# EAGLE design SparkFun LoRaSerial 868MHz - 1W (EAGLE 9.6.2)
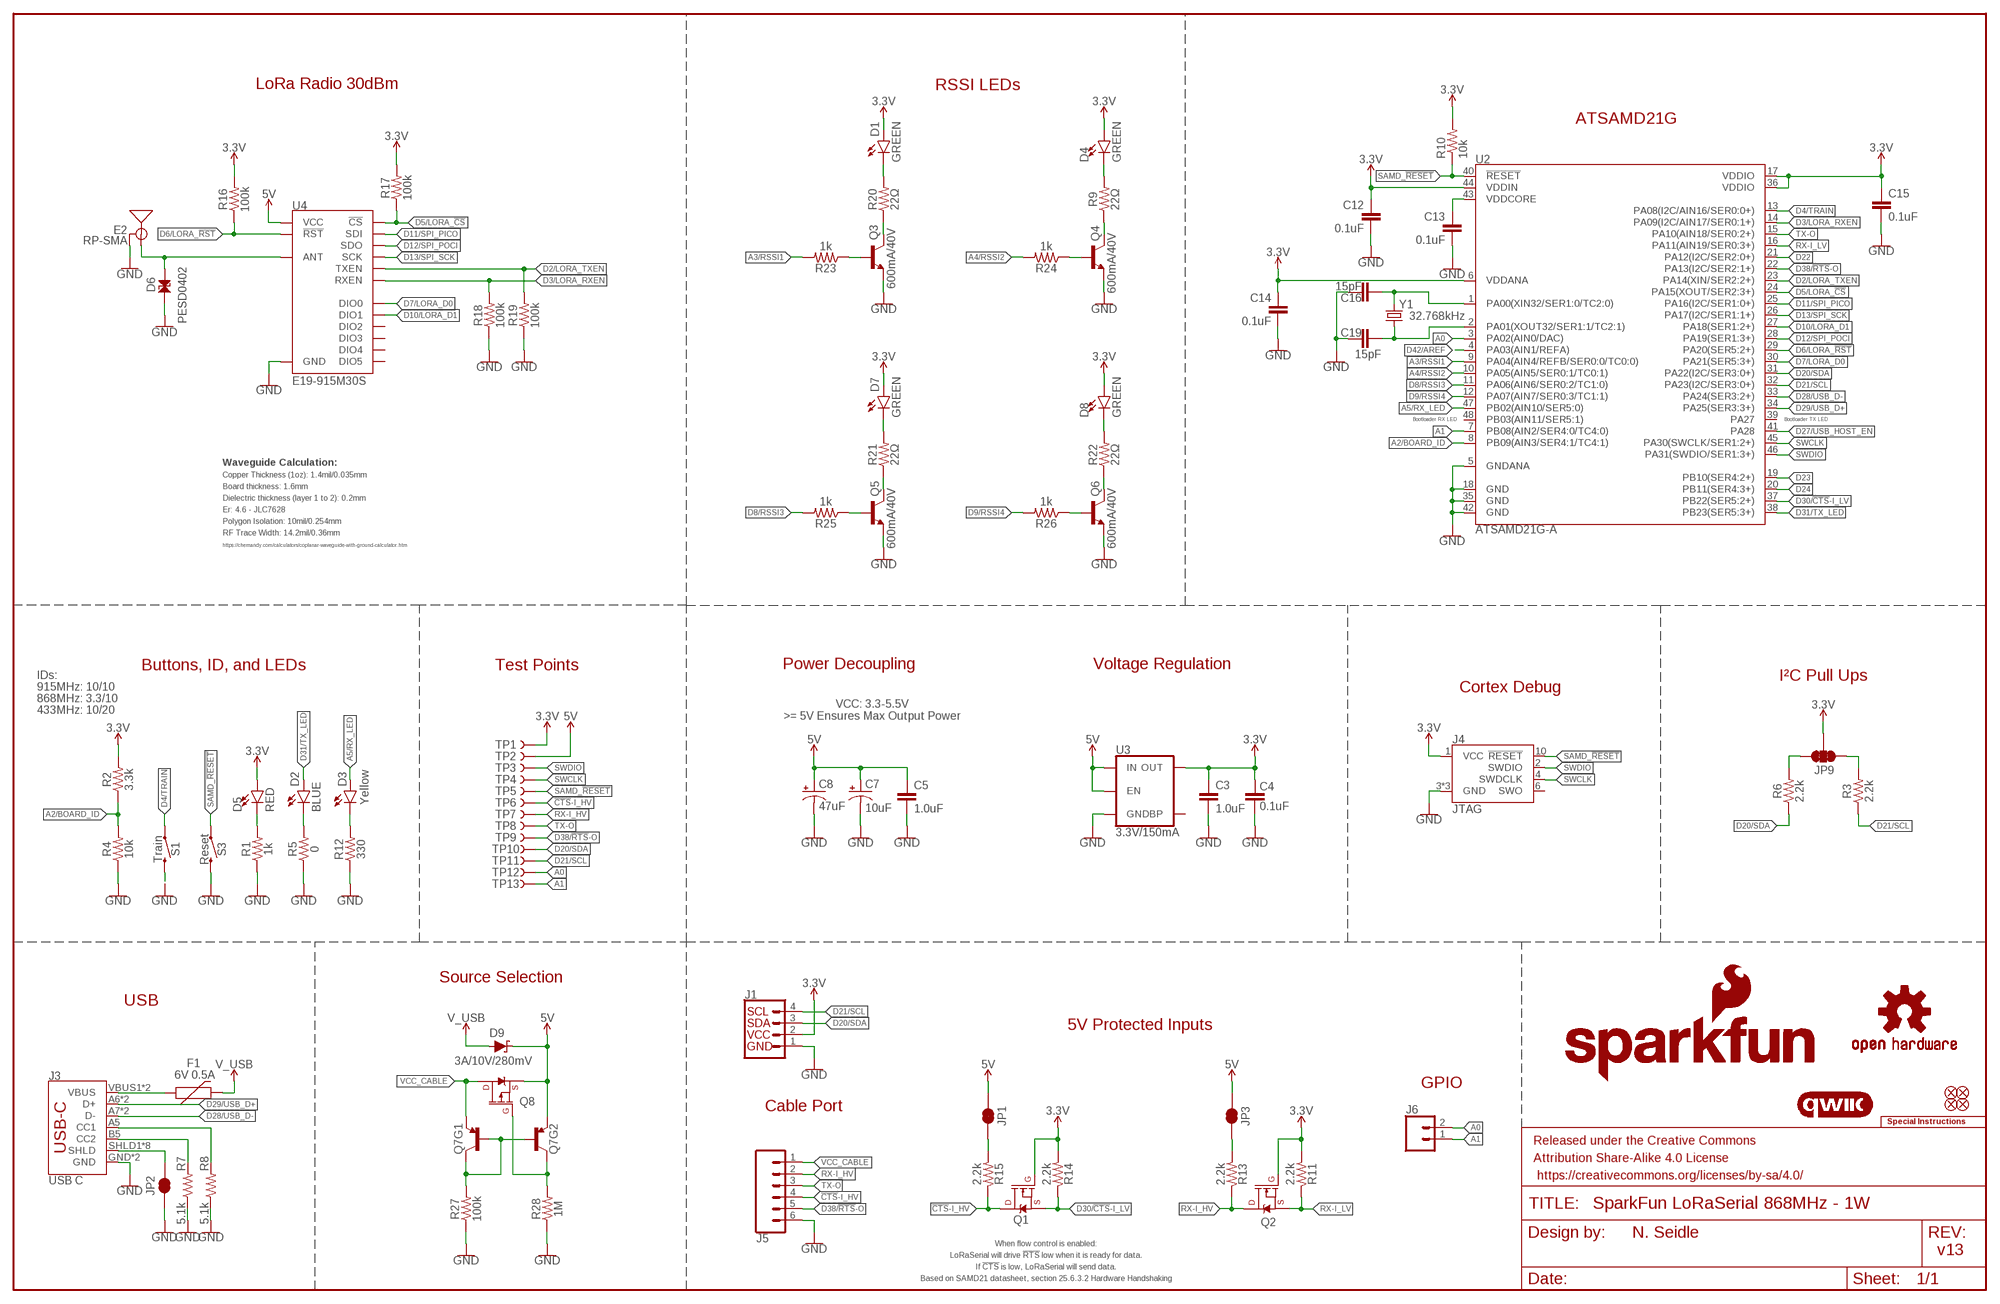
[diagram p0: schematic, sheet 1]

## Parts
C3  1.0uF  1.0UF-0603-16V-10%-X7R  [0603]
C4  0.1uF  0.1UF-0603-25V-5%  [0603]
C5  1.0uF  1.0UF-0603-16V-10%-X7R  [0603]
C7  10uF  10UF-POLAR-EIA3216-16V-10%(TANT)  [EIA3216]
C8  47uF  47UF-POLAR-EIA3528-10V-10%  [EIA3528]
C12  0.1uF  0.1UF-0603-25V-(+80/-20%)  [0603]
C13  0.1uF  0.1UF-0603-25V-(+80/-20%)  [0603]
C14  0.1uF  0.1UF-0603-25V-(+80/-20%)  [0603]
C15  0.1uF  0.1UF-0603-25V-(+80/-20%)  [0603]
C16  15pF  15PF-0603-50V-5%  [0603]
C19  15pF  15PF-0603-50V-5%  [0603]
D1  GREEN  LED-GREEN0603  [LED-0603]
D2  BLUE  LED-BLUE0603  [LED-0603]
D3  Yellow  LED-YELLOW0603  [LED-0603]
D4  GREEN  LED-GREEN0603  [LED-0603]
D5  RED  LED-RED0603  [LED-0603]
D6  PESD0402  PESD0402-0402T  [0402-TIGHT]
D7  GREEN  LED-GREEN0603  [LED-0603]
D8  GREEN  LED-GREEN0603  [LED-0603]
D9  3A/10V/280mV  DIODE-SCHOTTKY-BAT60A  [SOD-323]
E2  RP-SMA  ANTENNA-SMA-GROUNDEDEDGE_SMA  [SMA-EDGE]
F1  6V 0.5A  PPTC_6V500MA  [0805]
FID1  FIDUCIAL1X2  [FIDUCIAL-1X2]
FID2  FIDUCIAL1X2  [FIDUCIAL-1X2]
FID3  FIDUCIAL1X2  [FIDUCIAL-1X2]
FID4  FIDUCIAL1X2  [FIDUCIAL-1X2]
FRAME3  FRAME-LEDGER  [CREATIVE_COMMONS]
J1  QWIIC_RIGHT_ANGLE  QWIIC_CONNECTORJS-1MM  [JST04_1MM_RA]
J3  USB C  USB_C16PIN  [USB-C-16P]
J4  JTAG  CORTEX_JTAG_DEBUG_MINIMUM_PTH_NS  [2X5-PTH-1.27MM-NO_SILK]
J5  CONN_06JST-SMD-LOCKING  [JST-6-SMD-1.25MM-LOCKING]
J6  CONN_021X02_NO_SILK  [1X02_NO_SILK]
JP1  JUMPER-SMT_2_NC_TRACE_SILK  [SMT-JUMPER_2_NC_TRACE_SILK]
JP2  JUMPER-SMT_2_NC_TRACE_SILK  [SMT-JUMPER_2_NC_TRACE_SILK]
JP3  JUMPER-SMT_2_NC_TRACE_SILK  [SMT-JUMPER_2_NC_TRACE_SILK]
JP9  JUMPER-SMT_3_2-NC_TRACE_SILK  [SMT-JUMPER_3_2-NC_TRACE_SILK]
LOGO1  SPECIAL_INSTRUCTIONS-ORDERING  [ORDERING_INSTRUCTIONS]
LOGO2  SFE_LOGO_NAME_FLAME9_MM  [SFE_LOGO_NAME_FLAME_9MM]
LOGO3  QWIIC_LOGO_CONNECTOR  [QWIIC_5.5MM]
LOGO4  OSHW-LOGOMINI  [OSHW-LOGO-MINI]
LOGO5  SFE_LOGO_NAME9_MM  [SFE_LOGO_NAME_9MM]
Q1  20V/0.2A/8MHz/1.2Ω/1Vth  MOSFET-NCH-RE1C002UNTCL  [SOT-416FL]
Q2  20V/0.2A/8MHz/1.2Ω/1Vth  MOSFET-NCH-RE1C002UNTCL  [SOT-416FL]
Q3  600mA/40V  TRANS_NPN-MMBT2222AL  [SOT23-3]
Q4  600mA/40V  TRANS_NPN-MMBT2222AL  [SOT23-3]
Q5  600mA/40V  TRANS_NPN-MMBT2222AL  [SOT23-3]
Q6  600mA/40V  TRANS_NPN-MMBT2222AL  [SOT23-3]
Q7  TRANS_PNP_DUALSOT-363  [SOT363_PHILIPS]
Q8  20V/4.2A/52mΩ/1.4W  MOSFET_PCH-DMG2305UX-7  [SOT23-3]
R1  1k  1KOHM-0603-1/10W-1%  [0603]
R2  3.3k  3.3KOHM-0603-1/10W-1%  [0603]
R3  2.2k  2.2KOHM-0603-1/10W-1%  [0603]
R4  10k  10KOHM-0603-1/10W-1%  [0603]
R5  0  0OHM-0603-1/10W  [0603]
R6  2.2k  2.2KOHM-0603-1/10W-1%  [0603]
R7  5.1k  5.1KOHM5.1KOHM-0603-1/10W-1%  [0603]
R8  5.1k  5.1KOHM5.1KOHM-0603-1/10W-1%  [0603]
R9  22Ω  22OHM-0603-1/10W-1%  [0603]
R10  10k  10KOHM-0603-1/10W-1%  [0603]
R11  2.2k  2.2KOHM-0603-1/10W-1%  [0603]
R12  330  330OHM-0603-1/10W-1%  [0603]
R13  2.2k  2.2KOHM-0603-1/10W-1%  [0603]
R14  2.2k  2.2KOHM-0603-1/10W-1%  [0603]
R15  2.2k  2.2KOHM-0603-1/10W-1%  [0603]
R16  100k  100KOHM-0603-1/10W-1%  [0603]
R17  100k  100KOHM-0603-1/10W-1%  [0603]
R18  100k  100KOHM-0603-1/10W-1%  [0603]
R19  100k  100KOHM-0603-1/10W-1%  [0603]
R20  22Ω  22OHM-0603-1/10W-1%  [0603]
R21  22Ω  22OHM-0603-1/10W-1%  [0603]
R22  22Ω  22OHM-0603-1/10W-1%  [0603]
R23  1k  1KOHM-0603-1/10W-1%  [0603]
R24  1k  1KOHM-0603-1/10W-1%  [0603]
R25  1k  1KOHM-0603-1/10W-1%  [0603]
R26  1k  1KOHM-0603-1/10W-1%  [0603]
R27  100k  100KOHM-0603-1/10W-1%  [0603]
R28  1M  1MOHM-0603-1/4W-5%  [0603]
S1  Train  MOMENTARY-SWITCH-SPST-SMD-RIGHT-ANGLE  [TACTILE_SWITCH_SMD_RIGHT_ANGLE]
S3  Reset  MOMENTARY-SWITCH-SPST-SMD-5.2-TALL-REDUNDANT  [TACTILE_SWITCH_SMD_5.2MM]
TP1  TEST-POINT3X5  [PAD.03X.05]
TP2  TEST-POINT3X5  [PAD.03X.05]
TP3  TEST-POINT3X5  [PAD.03X.05]
TP4  TEST-POINT3X5  [PAD.03X.05]
TP5  TEST-POINT3X5  [PAD.03X.05]
TP6  TEST-POINT3X5  [PAD.03X.05]
TP7  TEST-POINT3X5  [PAD.03X.05]
TP8  TEST-POINT3X5  [PAD.03X.05]
TP9  TEST-POINT3X5  [PAD.03X.05]
TP10  TEST-POINT3X5  [PAD.03X.05]
TP11  TEST-POINT3X5  [PAD.03X.05]
TP12  TEST-POINT3X5  [PAD.03X.05]
TP13  TEST-POINT3X5  [PAD.03X.05]
U2  ATSAMD21G-A  [TQFP-48]
U3  3.3V/150mA  V_REG_MIC52053.3V  [SOT23-5]
U4  E19-915M30S  LORA-E19868MHZ  [E19-915M30S]
Y1  32.768kHz  CRYSTAL3.2X1.5MM  [CRYSTAL-SMD-3.2X1.5MM]

## Nets
3.3V [power]: C3.1 C4.2 C12.1 C14.1 C15.1 D1.A D4.A D5.A D7.A D8.A J1.2 J4.1(VCC) JP9.2 Q1.1(G) Q2.1(G) R2.2 R10.2 R11.2 R14.2 R16.2 R17.2 TP1.1 U2.6(VDDANA) U2.17(VDDIO) U2.36(VDDIO) U2.44(VDDIN) U3.5(OUT)
5V: C5.1 C7.+ C8.A(+) D9.C JP1.2 JP3.2 Q7.4(E) Q8.2(S) TP2.1 U3.1(IN) U3.3(EN) U4.11(VCC)
!CTS!-I_HV: J5.4 Q1.3(D) R15.1 TP6.1
A0: J6.2 TP12.1 U2.3(PA02(AIN0/DAC))
A1: J6.1 TP13.1 U2.7(PB08(AIN2/SER4:0/TC4:0))
A2/BOARD_ID: R2.1 R4.2 U2.8(PB09(AIN3/SER4:1/TC4:1))
A3/RSSI1: R23.2 U2.9(PA04(AIN4/REFB/SER0:0/TC0:0))
A4/RSSI2: R24.2 U2.10(PA05(AIN5/SER0:1/TC0:1))
A5/RX_LED: D3.A U2.47(PB02(AIN10/SER5:0))
CC1: J3.A5(CC1) R8.2
CC2: J3.B5(CC2) R7.2
D2/LORA_TXEN: R19.2 U2.23(PA14(XIN/SER2:2+)) U4.16(TXEN)
D3/LORA_RXEN: R18.2 U2.14(PA09(I2C/AIN17/SER0:1+)) U4.17(RXEN)
D4/TRAIN: S1.1 U2.13(PA08(I2C/AIN16/SER0:0+))
D5/LORA_!CS!: R17.1 U2.24(PA15(XOUT/SER2:3+)) U4.15(!CS)
D6/LORA_!RST!: R16.1 U2.29(PA20(SER5:2+)) U4.8(!RST)
D7/LORA_D0: U2.30(PA21(SER5:3+)) U4.7(DIO0)
D8/RSSI3: R25.2 U2.11(PA06(AIN6/SER0:2/TC1:0))
D9/RSSI4: R26.2 U2.12(PA07(AIN7/SER0:3/TC1:1))
D10/LORA_D1: U2.27(PA18(SER1:2+)) U4.6(DIO1)
D11/SPI_PICO: U2.25(PA16(I2C/SER1:0+)) U4.14(SDI)
D12/SPI_POCI: U2.28(PA19(SER1:3+)) U4.13(SDO)
D13/SPI_SCK: U2.26(PA17(I2C/SER1:1+)) U4.12(SCK)
D20/SDA: J1.3 R6.1 TP10.1 U2.31(PA22(I2C/SER3:0+))
D21/SCL: J1.4 R3.1 TP11.1 U2.32(PA23(I2C/SER3:0+))
D22: U2.21(PA12(I2C/SER2:0+))
D23: U2.19(PB10(SER4:2+))
D24: U2.20(PB11(SER4:3+))
D27/USB_HOST_EN: U2.41(PA28)
D28/USB_D-: J3.A7(D-) J3.B7(D-) U2.33(PA24(SER3:2+))
D29/USB_D+: J3.A6(D+) J3.B6(D+) U2.34(PA25(SER3:3+))
D30/!CTS!-I_LV: Q1.2(S) R14.1 U2.37(PB22(SER5:2+))
D31/TX_LED: D2.A U2.38(PB23(SER5:3+))
D38/!RTS!-O: J5.5 TP9.1 U2.22(PA13(I2C/SER2:1+))
D42/AREF: U2.4(PA03(AIN1/REFA))
GND: C3.2 C4.1 C5.2 C7.- C8.C(-) C12.2 C13.2 C14.2 C15.2 C16.1 C19.2 D6.1 E2.GND@0(GND) E2.GND@1(GND) E2.GND@2(GND) E2.GND@3(GND) J1.1 J3.GND J3.GND2(GND) J4.3(GND) J4.5(GND) J4.9(GND) J5.6 JP2.1 Q3.2(E) Q4.2(E) Q5.2(E) Q6.2(E) R1.1 R4.1 R5.1 R7.1 R8.1 R12.1 R18.1 R19.1 R27.1 R28.1 S1.2 S3.3 S3.4 U2.5(GNDANA) U2.18(GND) U2.35(GND) U2.42(GND) U3.2(GND) U4.1(GND) U4.9(GND) U4.10(GND) U4.18(GND) U4.20(GND) U4.21(GND) U4.22(GND)
LORA_ANT: D6.2 E2.SIG(SIGNAL) U4.19(ANT)
N$1: C19.1 U2.2(PA01(XOUT32/SER1:1/TC2:1)) Y1.P$1
N$2: C16.2 U2.1(PA00(XIN32/SER1:0/TC2:0)) Y1.P$2
N$3: D3.C R12.2
N$4: D2.C R5.2
N$5: JP3.1 R13.2
N$6: JP1.1 R15.2
N$7: D5.C R1.2
N$8: D4.C R9.2
N$9: D1.C R20.2
N$10: D7.C R21.2
N$11: D8.C R22.2
N$12: Q3.3(C) R20.1
N$13: Q3.1(B) R23.1
N$14: Q4.3(C) R9.1
N$15: Q4.1(B) R24.1
N$16: Q5.3(C) R21.1
N$17: Q5.1(B) R25.1
N$18: Q6.3(C) R22.1
N$19: Q6.1(B) R26.1
N$20: J3.SHLD1(SHLD) J3.SHLD2(SHLD) J3.SHLD3(SHLD) J3.SHLD4(SHLD) J3.SHLD5(SHLD) J3.SHLD6(SHLD) J3.SHLD7(SHLD) J3.SHLD8(SHLD) JP2.2
N$21: Q7.3(C) Q8.1(G) R28.2
N$22: Q7.2(B) Q7.5(B) Q7.6(C) R27.2
RX-I_HV: J5.2 Q2.3(D) R13.1 TP7.1
RX-I_LV: Q2.2(S) R11.1 U2.16(PA11(AIN19/SER0:3+))
SAMD_!RESET!: J4.10(!RESET) R10.1 S3.1 S3.2 TP5.1 U2.40(!RESET!)
SCL_PU1: JP9.1 R3.2
SDA_PU1: JP9.3 R6.2
SWCLK: J4.4(SWDCLK) TP4.1 U2.45(PA30(SWCLK/SER1:2+))
SWDIO: J4.2(SWDIO) TP3.1 U2.46(PA31(SWDIO/SER1:3+))
TX-O: J5.3 TP8.1 U2.15(PA10(AIN18/SER0:2+))
V_USB: D9.A F1.2
VCC_CABLE: J5.1 Q7.1(E) Q8.3(D)
VDDCORE: C13.1 U2.43(VDDCORE)
VUSB [power]: F1.1 J3.VBUS1(VBUS) J3.VBUS2(VBUS)
Unconnected: J4.6(SWO) U2.39(PA27) U2.48(PB03(AIN11/SER5:1)) U3.4(BP) U4.2(DIO5) U4.3(DIO4) U4.4(DIO3) U4.5(DIO2)

## Notes on the sheet
- LoRa Radio 30dBm | RSSI LEDs
- ATSAMD21G
- Bootloader RX LED | Bootloader TX LED
- Waveguide Calculation:
- Copper Thickness (1oz): 1.4mil/0.035mm
- Board thickness: 1.6mm
- Dielectric thickness (layer 1 to 2): 0.2mm
- Er: 4.6 - JLC7628
- Polygon Isolation: 10mil/0.254mm
- RF Trace Width: 14.2mil/0.36mm
- https://chemandy.com/calculators/coplanar-waveguide-with-ground-calculator.htm
- Buttons, ID, and LEDs | Test Points | Power Decoupling | Voltage Regulation
- IDs: | I²C Pull Ups
- 915MHz: 10/10 | Cortex Debug
- 868MHz: 3.3/10
- 433MHz: 10/20
- VCC: 3.3-5.5V
  >= 5V Ensures Max Output Power
- Source Selection
- USB
- 5V Protected Inputs
- GPIO
- Cable Port
- N. Seidle
- When flow control is enabled:
- LoRaSerial will drive !RTS! low when it is ready for data. | v13
- If !CTS! is low, LoRaSerial will send data.
- Based on SAMD21 datasheet, section 25.6.3.2 Hardware Handshaking

## Library data of the parts
C3 C5 = SparkFun-Capacitors:1.0UF: 1µF ceramic capacitors A capacitor is a passive two-terminal electrical component used to store electrical energy temporarily in an electric field.; PROD_ID: CAP-13930
C4 = SparkFun-Capacitors:0.1UF: 0.1µF ceramic capacitors A capacitor is a passive two-terminal electrical component used to store electrical energy temporarily in an electric field.; PROD_ID: CAP-08604
C7 = SparkFun-Capacitors:10UF-POLAR: 10.0µF polarized capacitors A capacitor is a passive two-terminal electrical component used to store electrical energy temporarily in an electric field.; PROD_ID: CAP-00811
C8 = SparkFun-Capacitors:47UF-POLAR: 47µF polarized capacitors A capacitor is a passive two-terminal electrical component used to store electrical energy temporarily in an electric field.; PROD_ID: CAP-08310
C12-C15 = SparkFun-Capacitors:0.1UF: 0.1µF ceramic capacitors A capacitor is a passive two-terminal electrical component used to store electrical energy temporarily in an electric field.; PROD_ID: CAP-00810
C16 C19 = SparkFun-Capacitors:15PF: 15pF ceramic capacitors A capacitor is a passive two-terminal electrical component used to store electrical energy temporarily in an electric field.; PROD_ID: CAP-07881
D1 D4 D7 D8 = SparkFun-LED:LED-GREEN: Green SMD LED Used in manufacturing of various products at SparkFun Packages: 0603 - SMD 0603 package [Product Link] <http://www.futureelectronics.com/en/technologies/semiconductors/optoelectronics/leds/Pages/9894312-LTST-C190GKT.aspx?CrossPart=HSMG-C190&IM=0> LilyPad 1206 - SMD1206 LilyPad package [Product Link] <http://www.futureelectronics.com/en/Technologies/Product.aspx?ProductID=IN150NGHARVATEKCORPORATION2049943&IM=0> 1206 - SMD1206 package [Product Link] <http://www.futureelectronics.com/en/technologies/semiconductors/optoelectronics/leds/Pages/8315665-LTST-C150KGKT.aspx?IM=0> 1206 Bottom Mount -SMD 1206 Bottom Mount [Product Link] <http://www.digikey.com/product-detail/en/lite-on-inc/LTST-C230KGKT/160-1456-1-ND/386854> SparkFun Products: Pro Mini 328 -5V <https://www.sparkfun.com/products/821> RedBoard <https://www.sparkfun.com/products/12757> MP3 Trigger <https://www.sparkfun.com/products/13720> Makey Makey <https://www.sparkfun.com/products/11076>; PROD_ID: DIO-00821
D2 = SparkFun-LED:LED-BLUE: Blue SMD LED Used in manufacturing of various products at SparkFun Packages: 0603 - SMD 0603 package [Product Link] <http://www.digikey.com/product-detail/en/SMLE12BC7TT86/511-1589-2-ND/1641808> 1206 - SMD1206 package [Product Link] <http://www.digikey.com/product-detail/en/lite-on-inc/LTST-C150TBKT/160-1643-1-ND/573584> SparkFun Products: ESP8266 Thing-Dev Board <https://www.sparkfun.com/products/13711> RedBoard <https://www.sparkfun.com/products/12757>; PROD_ID: DIO-08575
D3 = SparkFun-LED:LED-YELLOW: Yellow SMD LED Used in manufacturing several products at SparkFun. Packages: 0603 - SMD 0603 package[Product Link] <http://www.kingbrightusa.com/product.asp?catalog_name=LED&product_id=APT1608SYCK> 0603 -SMART - SMART SMD 0603 package (more efficient/more expensive) [Product Link] <http://www.osram-os.com/osram_os/en/products/product-catalog/led-light-emitting-diodes/smartled-0603/ly-l29k/index.jsp> LilyPad - SMD1206 package[Product Datasheet] <https://www.sparkfun.com/datasheets/DevTools/LilyPad/Q150YUS4.pdf> SparkFun Products: Blynk Board <https://www.sparkfun.com/products/13794> IOIO-OTG <https://www.sparkfun.com/products/13613> XBee Explorer Serial <https://www.sparkfun.com/products/13225>; PROD_ID: DIO-09003
D5 = SparkFun-LED:LED-RED: Red SMD LED Used in manufacturing of most products at SparkFun Packages: 0603 - SMD 0603 package [Product Link] <http://docs.avagotech.com/docs/AV02-0551EN> 0603 SMART - SMD 0603 SMART package ( more efficient and expensive)[Product Link] <http://www.osram-os.com/Graphics/XPic2/00077099_0.pdf> 1206 - SMD1206 package [Product Link] <https://www.sparkfun.com/datasheets/DevTools/LilyPad/Q150OVS4.pdff> SparkFun Products: Pro Mini 328 -5V <https://www.sparkfun.com/products/821> RedBoard <https://www.sparkfun.com/products/12757> IOIO-OTG <https://www.sparkfun.com/products/13613>; PROD_ID: DIO-00819
D6 = SparkFun-DiscreteSemi:PESD0402: ESD protection diode PESD is used to protect a signal line from ESD.; PROD_ID: DIO-15359
D9 = SparkFun-DiscreteSemi:DIODE-SCHOTTKY: Schottky diode A Schottky diode is a semiconductor diode which has a low forward voltage drop and a very fast switching action.; PROD_ID: DIO-14072
E2 = SparkFun-RF:ANTENNA-SMA-GROUNDED: SMA Antenna Connector w/ Ground Edge-mount and SMD SMA connectors for RF Antennas. **4-LAYER BOARD WARNING!!** When designing a 4-layer board using any of the SMD variants, you will need to manually add a cutout polygon on any internal power layers to make sure that you don't end up with exposed copper around the edge of the routed hole for these connectors. Exposed power copper could then short to the connector body - and that would be bad. Why hasn't anyone added the cutout polygons directly to the connector footprint? Well, your internal layers (usually 2 and 15) may be covered with GND polygons and you might well want the copper to go all the way to the edge, especially under the connector SIGNAL pin. So adding cutouts to the footprint might make matters worse, not better...; PROD_ID: CONN-08289
F1 = SparkFun-Fuses:PPTC: Resettable Fuse PPTC Resettable Fuse. Really a sort of resistor with a polymeric positive temperature coefficient whose resistance increases dramatically with an increase in temperature. When heated by the power passing through the resistance rises causing the current to be limited, protecting the circuit. This is achieved by the transition of the polymer from a crystalline to an amorphous state where the conductive carbon separates breaking the conductive pathways found in the cool crystalline structure. When a PPTC cools back down it resumes conducting letting the circuit turn back on. SparkFun Products: SparkFun RedBoard - Programmed with Arduino <https://www.sparkfun.com/products/12757> Pro Micro - 5V/16MHz <https://www.sparkfun.com/products/12640> Arduino Pro 328 - 5V/16MHz <https://www.sparkfun.com/products/10915> MP3 Trigger <https://www.sparkfun.com/products/13720>; PROD_ID: RES-13945
FID1-FID4 = SparkFun-Aesthetics:FIDUCIAL: Fiducial Alignment Points Point-of-reference for pick-and-place machines and other optical instruments.
FRAME3 = SparkFun-Aesthetics:FRAME-LEDGER: Schematic Frame - Ledger Standard 11x14 US Ledger frame
J1 = SparkFun-Connectors:QWIIC_CONNECTOR: SparkFun I2C Standard Qwiic Connector An SMD 1mm pitch JST connector makes it easy and quick (get it? Qwiic?) to connect I2C devices to each other. The Qwiic system <http://www.sparkfun.com/qwiic> enables fast and solderless connection between popular platforms and various sensors and actuators. We carry 200mm <https://www.sparkfun.com/products/14204>, 100mm <https://www.sparkfun.com/products/14205>, 50mm <https://www.sparkfun.com/products/14206>, and breadboard friendly <https://www.sparkfun.com/products/14207> Qwiic cables. We also offer 10 pcs strips <https://www.sparkfun.com/products/14323> the SMD connectors.; PROD_ID: CONN-13694
J3 = USB-C:USB_C: USB Type C 16Pin Connector
J4 = SparkFun-Connectors:CORTEX_JTAG_DEBUG_MINIMUM: Cortex Debug Connector - 10 pin Supports JTAG debug, Serial Wire debug, and Serial Wire Viewer. PTH and SMD connector options available. General Connector Information <http://infocenter.arm.com/help/topic/com.arm.doc.faqs/attached/13634/cortex_debug_connectors.pdf> Products: PTH Connector <http://www.digikey.com/product-detail/en/cnc-tech/3220-10-0100-00/1175-1627-ND/3883661> -via Digi-Key SparkFun PSoc <https://www.sparkfun.com/products/13229> SparkFun T <https://www.sparkfun.com/products/13810>
J5 = SparkFun-Connectors:CONN_06: Multi connection point. Often used as Generic Header-pin footprint for 0.1 inch spaced/style header connections On any of the 0.1 inch spaced packages, you can populate with these: Break Away Headers - Straight <https://www.sparkfun.com/products/116> (PRT-00116) Break Away Male Headers - Right Angle <https://www.sparkfun.com/products/553> (PRT-00553) Female Headers <https://www.sparkfun.com/products/115> (PRT-00115) Break Away Headers - Machine Pin <https://www.sparkfun.com/products/117> (PRT-00117) Break Away Female Headers - Swiss Machine Pin <https://www.sparkfun.com/products/743> (PRT-00743) Arduino Stackable Header - 6 Pin <https://www.sparkfun.com/products/9280> (PRT-09280) For SCREWTERMINALS and SPRING TERMINALS visit here: Screw Terimnals on SparkFun.com <https://www.sparkfun.com/search/results?term=Screw+Terminals> (5mm/3.5mm/2.54mm spacing) This device is also useful as a general connection point to wire up your design to another part of your project. Our various solder wires solder well into these plated through hole pads. Hook-Up Wire - Assortment (Stranded, 22 AWG) <https://www.sparkfun.com/products/11375> (PRT-11375) Hook-Up Wire - Assortment (Solid Core, 22 AWG) <https://www.sparkfun.com/products/11367> (PRT-11367) View the entire wire category on our website here <https://www.sparkfun.com/categories/141>; PROD_ID: CONN-16497
J6 = SparkFun-Connectors:CONN_02: Multi connection point. Often used as Generic Header-pin footprint for 0.1 inch spaced/style header connections On any of the 0.1 inch spaced packages, you can populate with these: Break Away Headers - Straight <https://www.sparkfun.com/products/116> (PRT-00116) Break Away Male Headers - Right Angle <https://www.sparkfun.com/products/553> (PRT-00553) Female Headers <https://www.sparkfun.com/products/115> (PRT-00115) Break Away Headers - Machine Pin <https://www.sparkfun.com/products/117> (PRT-00117) Break Away Female Headers - Swiss Machine Pin <https://www.sparkfun.com/products/743> (PRT-00743) For SCREWTERMINALS and SPRING TERMINALS visit here: Screw Terimnals on SparkFun.com <https://www.sparkfun.com/search/results?term=Screw+Terminals> (5mm/3.5mm/2.54mm spacing) This device is also useful as a general connection point to wire up your design to another part of your project. Our various solder wires solder well into these plated through hole pads. Hook-Up Wire - Assortment (Stranded, 22 AWG) <https://www.sparkfun.com/products/11375> (PRT-11375) Hook-Up Wire - Assortment (Solid Core, 22 AWG) <https://www.sparkfun.com/products/11367> (PRT-11367) View the entire wire category on our website here <https://www.sparkfun.com/categories/141> Special notes: Molex polarized connector foot print use with: PRT-08233 with associated crimp pins and housings. 2.54_SCREWTERM for use with PRT-10571. 3.5mm Screw Terminal footprints for PRT-08084 5mm Screw Terminal footprints for use with PRT-08432
JP1-JP3 = SparkFun-Jumpers:JUMPER-SMT_2_NC_TRACE: Normally closed trace jumper This jumper has a trace between two pads so it's normally closed (NC). Use a razor knife to open the connection. For best results follow the IPC guidelines for cutting traces: Cutout at least 0.063 mm (0.005 in). Remove all loose material to clean up the cut area. Seal the cut with an approved epoxy. Reapply solder to reclose the connection.
JP9 = SparkFun-Jumpers:JUMPER-SMT_3_2-NC_TRACE: Normally closed trace jumper (2 of 2 connections) This jumper has a trace between all three pads so they are normally closed (NC). Use a razor knife to open the connection(s). For best results follow the IPC guidelines for cutting traces: Cutout at least 0.063 mm (0.005 in). Remove all loose material to clean up the cut area. Seal the cut with an approved epoxy. Reapply solder to reclose the connection(s).
LOGO1 = SparkFun-Aesthetics:SPECIAL_INSTRUCTIONS: Special Ordering/Production Instructions Alert Symbol for special PCB ordering instructions or unique production process warnings. Ordering Instructions Production Instructions Types of information that should be added to box: Copper weight Soldermask color Silk color PCB thickness Number of layers PCB Standard: 1.6mm FR4 1 oz copper immersion silver plating red soldermask white silkscreen Types of information that should be added to box: Special wash requirements Depaneling instructions Humidification Glue curing Default text settings: 0.07 inch 9% ratio 50% line distance
LOGO2 = SparkFun-Aesthetics:SFE_LOGO_NAME_FLAME: SparkFun Font Logo w/ Flame This is the SparkFun full logo. The logo on the schematic will always be the same size; the package variant is the height of the flame part of the logo. Default layer for the logo on the board is tSilk.
LOGO3 = SparkFun-Aesthetics:QWIIC_LOGO: Qwiic Logos for placement on schematic and PCB. The 5.5mm silk logo is best for placing next to Qwiic connector.
LOGO4 = SparkFun-Aesthetics:OSHW-LOGO: Open-Source Hardware (OSHW) Logo This logo indicates the piece of hardware it is found on incorporates a OSHW license and/or adheres to the definition of open source hardware found here: http://freedomdefined.org/OSHW
LOGO5 = SparkFun-Aesthetics:SFE_LOGO_NAME: SparkFun Font Logo This is the SparkFun name logo. The logo on the schematic will always be the same size; the package variant is the height of the flame part of the logo (or the height the flame would be, if it were drawn). Default layer for the logo on the board is tSilk.
Q1 Q2 = SparkFun-DiscreteSemi:MOSFET-NCH: N-channel MOSFETs Voltage controlled devices that allow control of high current outputs. SparkFun Products: SparkFun OpenScale <https://www.sparkfun.com/products/13261> SparkFun Digital Sandbox <https://www.sparkfun.com/products/12651> SparkFun Monster Moto Shield <https://www.sparkfun.com/products/10182> SparkFun MOSFET Power Controller <https://www.sparkfun.com/products/11214>; PROD_ID: TRANS-14399
Q3-Q6 = SparkFun-DiscreteSemi:TRANS_NPN: NPN transistor Current controlled devices typically used to amplify current or used as a switch. BC547 - COM-08928 <http://www.sparkfun.com/products/8928> (TO-92 45V 100mA) (1.Collector 2.Base 3.Emitter) 2N3904 - COM-00521 <http://www.sparkfun.com/products/521> (TO-92 40V 200mA) (1.Emitter 2.Base 3.Collector) P2N2222A - COM-12852 <http://www.sparkfun.com/products/12852> (TO-92 40V 600mA) (1.Collector 2.Base 3.Emitter); PROD_ID: TRANS-08049
Q7 = SparkFun-DiscreteSemi:TRANS_PNP_DUAL: Dual PNP Transistors in Single Package The BCM857BS puts two PNP transistors in a single package. Bipolar (BJT) Transistor Array 2 PNP (Dual) 45V 100mA 100MHz 200mW Surface Mount SOT-363 Datasheet <https://www.diodes.com/assets/Datasheets/BCM857BS.pdf> SparkFun Products: SparkFun Pi Servo HAT V2 <https://www.sparkfun.com>; PROD_ID: TRANS-14386
Q8 = SparkFun-DiscreteSemi:MOSFET_PCH: P-channel MOSFETs Voltage controlled devices that allow control of high current outputs. SparkFun Products: SparkFun ESP32 Thing <https://www.sparkfun.com/products/13907> SparkFun ESP8266 Thing <https://www.sparkfun.com/products/13231> SparkFun Pi Servo HAT V2 <https://www.sparkfun.com/products/15316> DMG2305UX-7 (20V/4.2A/SOT23-3); PROD_ID: TRANS-14388
R1 R23-R26 = SparkFun-Resistors:1KOHM: 1kΩ resistor A resistor is a passive two-terminal electrical component that implements electrical resistance as a circuit element. Resistors act to reduce current flow, and, at the same time, act to lower voltage levels within circuits. - Wikipedia; PROD_ID: RES-07856
R2 = SparkFun-Resistors:3.3KOHM: 3.3kΩ resistor A resistor is a passive two-terminal electrical component that implements electrical resistance as a circuit element. Resistors act to reduce current flow, and, at the same time, act to lower voltage levels within circuits. - Wikipedia; PROD_ID: RES-07851
R3 R6 R11 R13-R15 = SparkFun-Resistors:2.2KOHM: 2.2kΩ resistor A resistor is a passive two-terminal electrical component that implements electrical resistance as a circuit element. Resistors act to reduce current flow, and, at the same time, act to lower voltage levels within circuits. - Wikipedia; PROD_ID: RES-08272
R4 R10 = SparkFun-Resistors:10KOHM: 10kΩ resistor A resistor is a passive two-terminal electrical component that implements electrical resistance as a circuit element. Resistors act to reduce current flow, and, at the same time, act to lower voltage levels within circuits. - Wikipedia; PROD_ID: RES-00824
R5 = SparkFun-Resistors:0OHM: 0Ω resistor A resistor is a passive two-terminal electrical component that implements electrical resistance as a circuit element. Resistors act to reduce current flow, and, at the same time, act to lower voltage levels within circuits. - Wikipedia; PROD_ID: RES-08609
R7 R8 = SparkFun-Resistors:5.1KOHM; PROD_ID: RES-12083
R9 R20-R22 = SparkFun-Resistors:22OHM: 22Ω resistor A resistor is a passive two-terminal electrical component that implements electrical resistance as a circuit element. Resistors act to reduce current flow, and, at the same time, act to lower voltage levels within circuits. - Wikipedia; PROD_ID: RES-08698
R12 = SparkFun-Resistors:330OHM: 330Ω resistor A resistor is a passive two-terminal electrical component that implements electrical resistance as a circuit element. Resistors act to reduce current flow, and, at the same time, act to lower voltage levels within circuits. - Wikipedia; PROD_ID: RES-00818
R16-R19 R27 = SparkFun-Resistors:100KOHM: 100kΩ resistor A resistor is a passive two-terminal electrical component that implements electrical resistance as a circuit element. Resistors act to reduce current flow, and, at the same time, act to lower voltage levels within circuits. - Wikipedia; PROD_ID: RES-07828
R28 = SparkFun-Resistors:1MOHM: 1MΩ resistor A resistor is a passive two-terminal electrical component that implements electrical resistance as a circuit element. Resistors act to reduce current flow, and, at the same time, act to lower voltage levels within circuits. - Wikipedia; PROD_ID: RES-07868
S1 = SparkFun-Switches:MOMENTARY-SWITCH-SPST: Momentary Switch (Pushbutton) - SPST Normally-open (NO) SPST momentary switches (buttons, pushbuttons). Variants PTH-12MM - 12mm square, through-hole Momentary Pushbutton Switch - 12mm Square <https://www.sparkfun.com/products/9190> (COM-09190) PTH-6.0MM, PTH-6.0MM-KIT - 6.0mm square, through-hole Mini Pushbutton Switch <https://www.sparkfun.com/products/97> (COM-00097) KIT package intended for soldering kit's - only one side of pads' copper is exposed. PTH-RIGHT-ANGLE-KIT - Right-angle, through-hole Right Angle Tactile Button <https://www.sparkfun.com/products/10791> - Used on SparkFun BigTime Watch Kit <https://www.sparkfun.com/products/11734> SMD-12MM - 12mm square, surface-mount Tactile Button - SMD (12mm) <https://www.sparkfun.com/products/12993> (COM-12993) Used on SparkFun PicoBoard <https://www.sparkfun.com/products/11888> SMD-4.5MM - 4.5mm Square Trackball Switch Used on SparkFun Blackberry Trackballer Breakout <https://www.sparkfun.com/products/13169> SMD-4.6MMX2.8MM - 4.60mm x 2.80mm, surface mount Used on SparkFun Pro Micro - RP2040 <https://www.sparkfun.com/products/17717> SMD-5.2MM, SMD-5.2-REDUNDANT - 5.2mm square, surface-mount Mini Pushbutton Switch - SMD <https://www.sparkfun.com/products/8720> (COM-08720) Used on Arduino Pro Mini <https://www.sparkfun.com/products/11114> REDUNDANT package connects both switch circuits together SMD-6.0X3.5MM - 6.0 x 3.5mm, surface mount Momentary Reset Switch SMD <https://www.sparkfun.com/products/8229> (COM-08229) SMD-6.2MM-TALL - 6.2mm square, surface mount Tactile Button - SMD (6mm) <https://www.sparkfun.com/products/12992> Used on SparkFun Digital Sandbox <https://www.sparkfun.com/products/12651> SMD-RIGHT-ANGLE - Right-angle, surface mount Used on SparkFun Block for Intel® Edison - Arduino <https://www.sparkfun.com/products/13036>; PROD_ID: COMP-12265
S3 = SparkFun-Switches:MOMENTARY-SWITCH-SPST: Momentary Switch (Pushbutton) - SPST Normally-open (NO) SPST momentary switches (buttons, pushbuttons). Variants PTH-12MM - 12mm square, through-hole Momentary Pushbutton Switch - 12mm Square <https://www.sparkfun.com/products/9190> (COM-09190) PTH-6.0MM, PTH-6.0MM-KIT - 6.0mm square, through-hole Mini Pushbutton Switch <https://www.sparkfun.com/products/97> (COM-00097) KIT package intended for soldering kit's - only one side of pads' copper is exposed. PTH-RIGHT-ANGLE-KIT - Right-angle, through-hole Right Angle Tactile Button <https://www.sparkfun.com/products/10791> - Used on SparkFun BigTime Watch Kit <https://www.sparkfun.com/products/11734> SMD-12MM - 12mm square, surface-mount Tactile Button - SMD (12mm) <https://www.sparkfun.com/products/12993> (COM-12993) Used on SparkFun PicoBoard <https://www.sparkfun.com/products/11888> SMD-4.5MM - 4.5mm Square Trackball Switch Used on SparkFun Blackberry Trackballer Breakout <https://www.sparkfun.com/products/13169> SMD-4.6MMX2.8MM - 4.60mm x 2.80mm, surface mount Used on SparkFun Pro Micro - RP2040 <https://www.sparkfun.com/products/17717> SMD-5.2MM, SMD-5.2-REDUNDANT - 5.2mm square, surface-mount Mini Pushbutton Switch - SMD <https://www.sparkfun.com/products/8720> (COM-08720) Used on Arduino Pro Mini <https://www.sparkfun.com/products/11114> REDUNDANT package connects both switch circuits together SMD-6.0X3.5MM - 6.0 x 3.5mm, surface mount Momentary Reset Switch SMD <https://www.sparkfun.com/products/8229> (COM-08229) SMD-6.2MM-TALL - 6.2mm square, surface mount Tactile Button - SMD (6mm) <https://www.sparkfun.com/products/12992> Used on SparkFun Digital Sandbox <https://www.sparkfun.com/products/12651> SMD-RIGHT-ANGLE - Right-angle, surface mount Used on SparkFun Block for Intel® Edison - Arduino <https://www.sparkfun.com/products/13036>; PROD_ID: SWCH-14139
TP1-TP13 = SparkFun-Connectors:TEST-POINT: SparkFun Test Points Bare copper test points for troubleshooting or In-Circuit-Testing. These are used by our Production team for verifying production board runs using pogo-pins on test beds. SparkFun Products: SparkFun LSM9DS1 Breakout <https://www.sparkfun.com/products/13284> SparkFun PSOC <https://www.sparkfun.com/products/13714> SparkFun Load Cell Amplifier <https://www.sparkfun.com/products/13879>
U2 = samd21-temp:ATSAMD21G: Atmel SAMD21G SMART ARM-Based Microcontroller The Atmel ® | SMART ™ SAM D21 is a series of low-power microcontrollers using the 32-bit ARM ® Cortex ® -M0+ processor, and ranging from 32- to 64-pins with up to 256KB Flash and 32KB of SRAM. The SAM D21 devices operate at a maximum frequency of 48MHz and reach 2.46 CoreMark/MHz. They are designed for simple and intuitive migration with identical peripheral modules, hex compatible code, identical linear address map and pin compatible migration paths between all devices in the product series. All devices include intelligent and flexible peripherals, Atmel Event System for inter-peripheral signaling, and support for capacitive touch button, slider and wheel user interfaces.; PROD_ID: IC-13064
U3 = SparkFun-IC-Power:V_REG_MIC5205: V_REG MIC5205 Standard 3.3V, 5V, and Adjustable 150mA LDO voltage regulator in SOT-23 layout. Micrel part MIC5205. BP (by-pass) pin is used to lower output noise with 470pF cap, may be left open. On the adjustable version BP is used to set output.; PROD_ID: VREG-00822
U4 = SparkFun-RF:LORA-E19: Chengdu Ebyte E19-915M30S - 915/868/433MHz LoRa (FSK) TRX Using SX1276 This is a LoRa (or optionally FSK) modulated transciver bassed on the Semtech SX1276. It has a high ouput power of 1W an a pre-installed U.FL connector. Can be used with LoRa WAN with DIO0, DIO1, and DIO2 hooked up to controller interrupt inputs SparkFun Products: SAMD21 Pro RF 1W <https://www.sparkfun.com/products/15034>; PROD_ID: IC-16573
Y1 = samd21-temp:CRYSTAL: Various standard crystals. Proven footprints.; PROD_ID: XTAL-13062

## Board
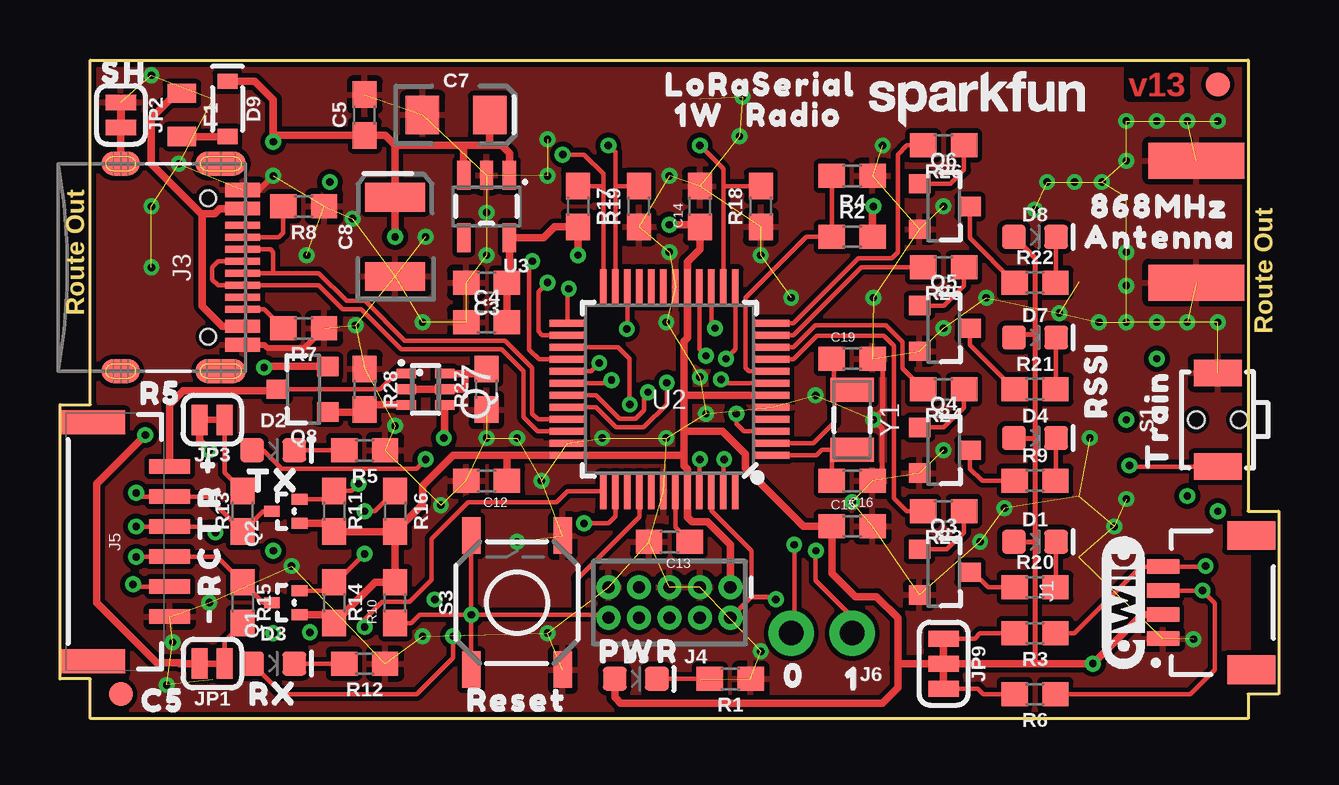
[diagram p1: board, top side]
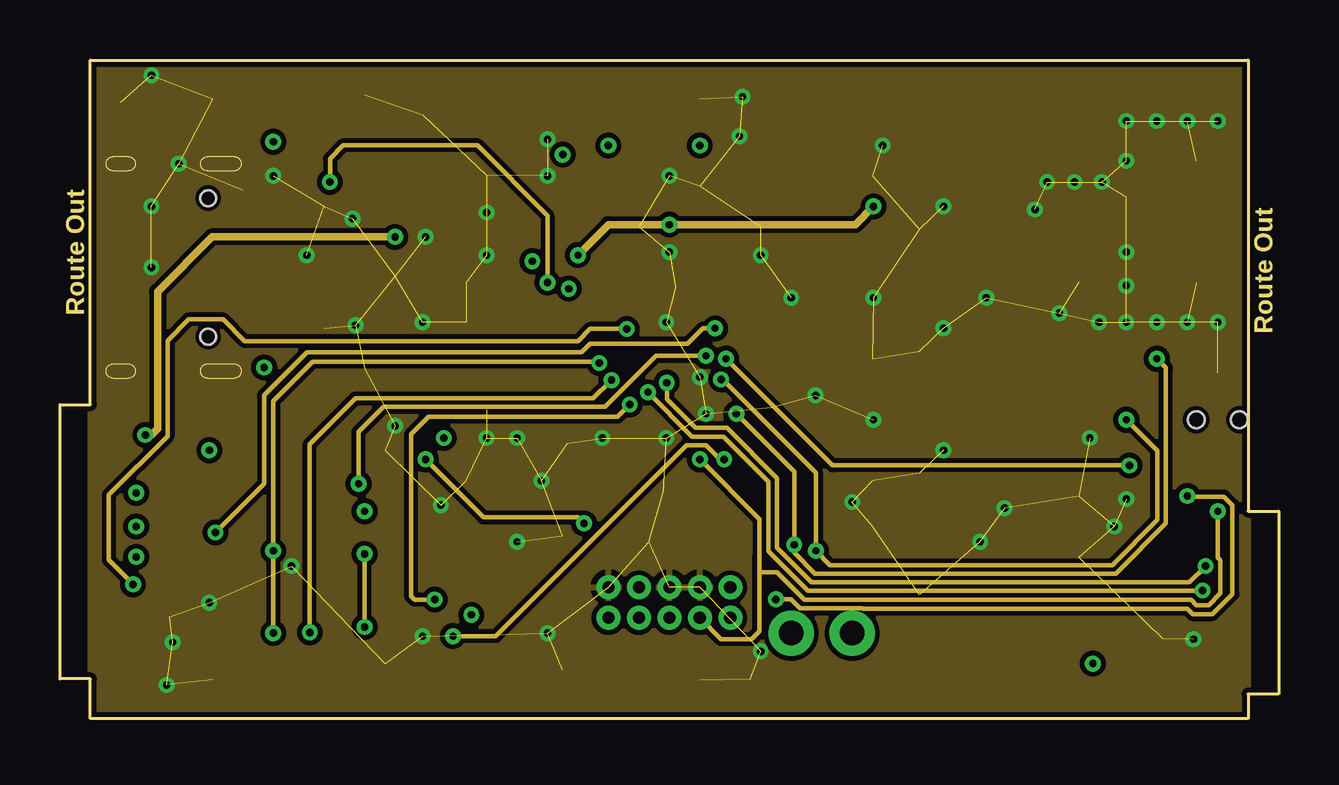
[diagram p2: board, inner layer Digital]
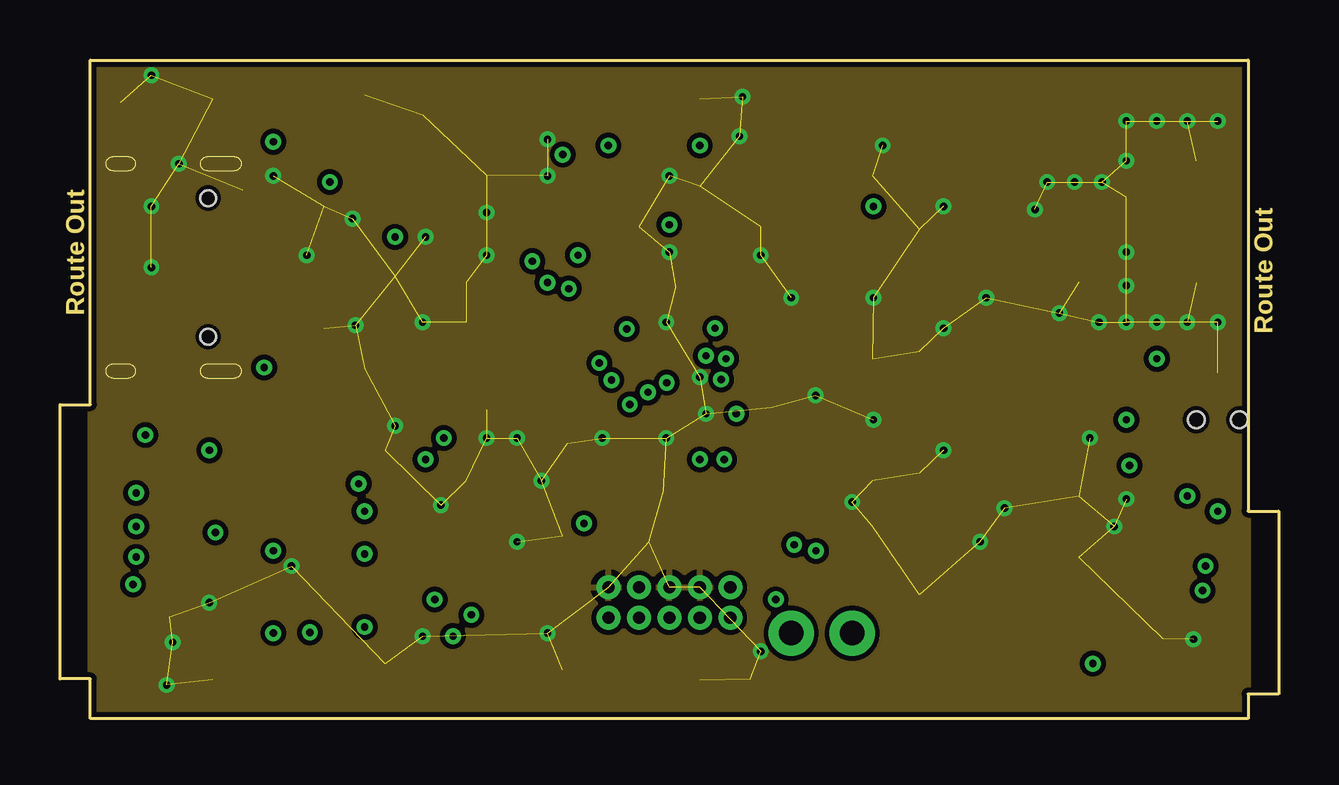
[diagram p3: board, inner layer GND]
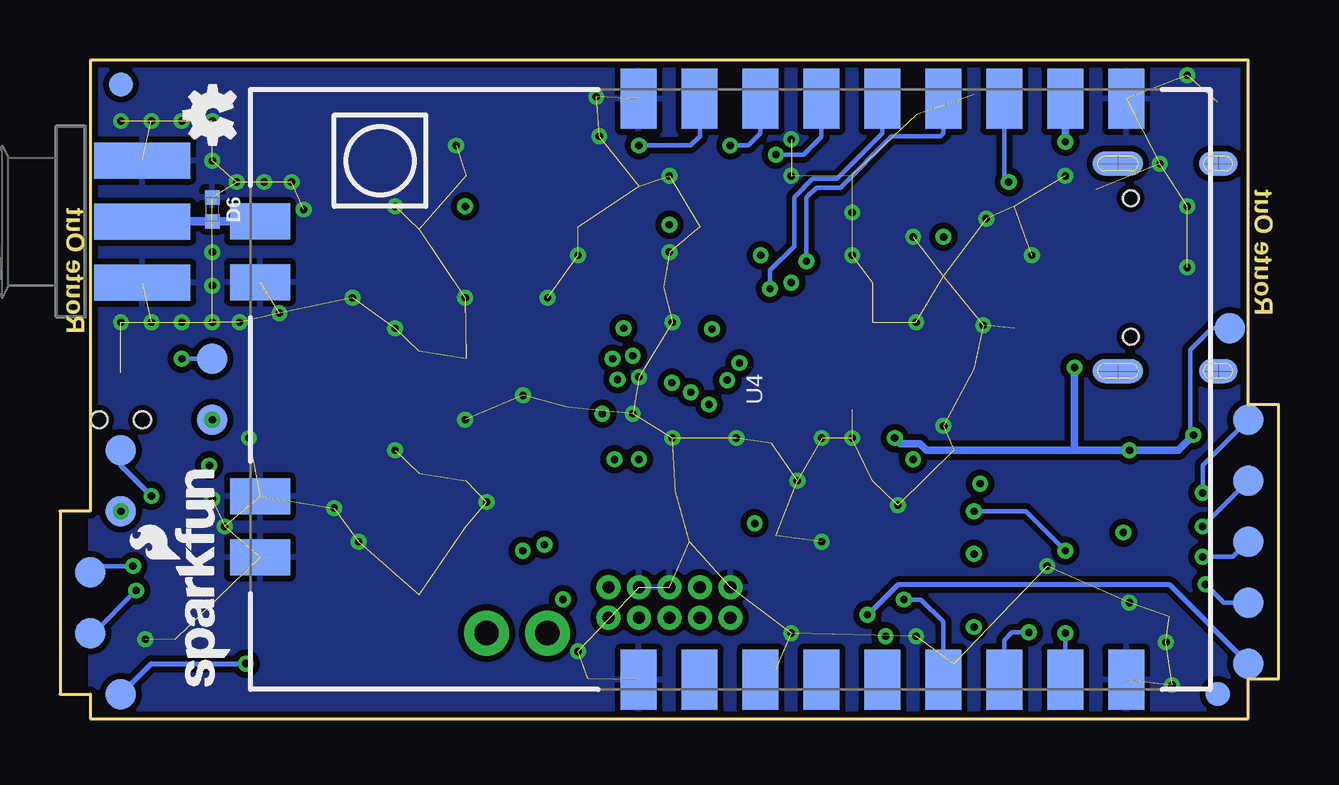
[diagram p4: board, bottom side, seen from below]

Size 50.8 x 27.44 mm. Coordinates in mm from the lower left corner, seen from the top.
Outline: 1.27,0 1.27,1.66 0,1.66 0,13.09 1.27,13.09 1.27,27.44 49.53,27.44 49.53,8.64 50.8,8.64 50.8,1.02 49.53,1.02 49.53,0 1.27,0
Copper layers (1+2*15+16): Top 0.035559375mm / dielectric 0.47751875mm / Digital 0.035559375mm / dielectric 0.47751875mm / GND 0.035559375mm / dielectric 0.47751875mm / Bottom 0.035559375mm
Design rules "SparkFun-4-Layer-General-JLCPCB": minimum track width 7mil, minimum drill 12mil, track to track 7mil, track to pad 7mil, pad to pad 7mil, via to via 7mil, smd to smd 7mil, copper to edge 7mil, drill to drill 7mil, minimum pad ring 7mil, minimum via ring 7mil, stop-mask expansion 3mil, vias tented up to drill 25mil, thermal gap 10mil

### Footprints (pad centres in the part's own frame; a part is rotated, then mirrored left to right if it is on the bottom)
0603 = smd 1.1 x 1: 1 -0.85,0; 2 0.85,0
EIA3216 = smd 1.4 x 1.6: + 1.4,0; - -1.4,0
EIA3528 = smd 1.2 x 2.5: A 1.65,0; C -1.65,0
LED-0603 = smd 1 x 1: A -0.877,0; C 0.877,0
0402-TIGHT = smd 0.6 x 0.6: 1 -0.5,0; 2 0.5,0
SOD-323 = smd 0.63 x 0.83: A 1.15,0; C -1.15,0
SMA-EDGE = smd 1.5 x 4: GND@0 -2.54,0; GND@1 2.54,0; SIG 0,0 | smd 1.5 x 4 bottom: GND@2 -2.54,0; GND@3 2.54,0
0805 = smd 0.8 x 1.2: 1 -0.9,0; 2 0.9,0
FIDUCIAL-1X2 = smd 1 x 1: 1 0,0
JST04_1MM_RA = smd 0.6 x 1.35: 1 -1.5,0; 2 -0.5,0; 3 0.5,0; 4 1.5,0 | smd 1.2 x 2: NC1 2.8,-3.675; NC2 -2.8,-3.675
USB-C-16P = smd 0.3 x 1.45: A5 -1.25,0; A6 -0.25,0; A7 0.25,0; A8 1.25,0; B5 1.75,0; B6 0.75,0; B7 -0.75,0; B8 -1.75,0 | smd 0.6 x 1.45: GND -3.225,0; GND2 3.225,0 | smd 1 x 2.1: SHLD1 -4.32,-0.915; SHLD2 4.32,-0.915 | smd 1 x 2.1 bottom: SHLD3 -4.32,-0.915; SHLD4 4.32,-0.915 | smd 1 x 1.6: SHLD5 -4.32,-5.095; SHLD8 4.32,-5.095 | smd 1 x 1.6 bottom: SHLD6 -4.32,-5.095; SHLD7 4.32,-5.095 | smd 0.55 x 1.45: VBUS1 -2.45,0; VBUS2 2.45,0 | hole 0.65: -2.89,-1.445; 2.89,-1.445
2X5-PTH-1.27MM-NO_SILK = drill 0.508 pad 1: 1 -2.54,-0.635; 2 -2.54,0.635; 3 -1.27,-0.635; 4 -1.27,0.635; 5 0,-0.635; 6 0,0.635; 7 1.27,-0.635; 8 1.27,0.635; 9 2.54,-0.635; 10 2.54,0.635
JST-6-SMD-1.25MM-LOCKING = smd 0.6 x 1.7: 1 -3.125,3.3; 2 -1.875,3.3; 3 -0.625,3.3; 4 0.625,3.3; 5 1.875,3.3; 6 3.125,3.3 | smd 1 x 2.7: NC1 4.975,0.1; NC2 -4.975,0.1
1X02_NO_SILK = drill 1.016 pad 1.88: 1 0,0; 2 2.54,0
SMT-JUMPER_2_NC_TRACE_SILK = smd 0.66 x 1.27: 1 -0.521,0; 2 0.521,0
SMT-JUMPER_3_2-NC_TRACE_SILK = smd 0.66 x 1.27: 1 -1.041,0; 2 0,0; 3 1.041,0
SOT-416FL = smd 0.46 x 0.65: 1 -0.5,-1.1; 2 0.5,-1.1; 3 0,0.05
SOT23-3 = smd 0.8 x 0.9: 1 -0.95,-1; 2 0.95,-1; 3 0,1.1
SOT363_PHILIPS = smd 0.4 x 0.8: 1 -0.65,-0.8; 2 0,-0.8; 3 0.65,-0.8; 4 0.65,0.8; 5 0,0.8; 6 -0.65,0.8
TACTILE_SWITCH_SMD_RIGHT_ANGLE = smd 1.1 x 2: 1 -1.95,0; 2 1.95,0 | hole 0.7: 0,0.9; 0,-0.9
TACTILE_SWITCH_SMD_5.2MM = smd 1.524 x 0.762: 1 -2.794,1.905; 2 2.794,1.905; 3 -2.794,-1.905; 4 2.794,-1.905
PAD.03X.05 = smd 1.27 x 1.27: 1 0,0
TQFP-48 = smd 1.5 x 0.28: 1 -4.25,2.75; 2 -4.25,2.25; 3 -4.25,1.75; 4 -4.25,1.25; 5 -4.25,0.75; 6 -4.25,0.25; 7 -4.25,-0.25; 8 -4.25,-0.75; 9 -4.25,-1.25; 10 -4.25,-1.75; 11 -4.25,-2.25; 12 -4.25,-2.75; 25 4.25,-2.75; 26 4.25,-2.25; 27 4.25,-1.75; 28 4.25,-1.25; 29 4.25,-0.75; 30 4.25,-0.25; 31 4.25,0.25; 32 4.25,0.75; 33 4.25,1.25; 34 4.25,1.75; 35 4.25,2.25; 36 4.25,2.75 | smd 0.28 x 1.5: 13 -2.75,-4.25; 14 -2.25,-4.25; 15 -1.75,-4.25; 16 -1.25,-4.25; 17 -0.75,-4.25; 18 -0.25,-4.25; 19 0.25,-4.25; 20 0.75,-4.25; 21 1.25,-4.25; 22 1.75,-4.25; 23 2.25,-4.25; 24 2.75,-4.25; 37 2.75,4.25; 38 2.25,4.25; 39 1.75,4.25; 40 1.25,4.25; 41 0.75,4.25; 42 0.25,4.25; 43 -0.25,4.25; 44 -0.75,4.25; 45 -1.25,4.25; 46 -1.75,4.25; 47 -2.25,4.25; 48 -2.75,4.25
SOT23-5 = smd 0.55 x 1.2: 1 -0.95,-1.3; 2 0,-1.3; 3 0.95,-1.3; 4 0.95,1.3; 5 -0.95,1.3
E19-915M30S = smd 2.5 x 1.5: 1 12.1,-3.82; 2 12.1,-1.28; 3 12.1,1.26; 4 12.1,3.8; 5 12.1,6.34; 6 12.1,8.88; 7 12.1,11.42; 8 12.1,13.96; 9 12.1,16.5; 10 -12.1,16.5; 11 -12.1,13.96; 12 -12.1,11.42; 13 -12.1,8.88; 14 -12.1,6.34; 15 -12.1,3.8; 16 -12.1,1.26; 17 -12.1,-1.28; 18 -12.1,-3.82 | smd 1.5 x 2.5: 19 -7,-19.6; 20 -4.46,-19.6; 21 4.46,-19.6; 22 7,-19.6
CRYSTAL-SMD-3.2X1.5MM = smd 1 x 1.8: P$1 -1.25,0; P$2 1.25,0

### Placement (x,y rotation side)
C3  17.78,18.16 180 top
C4  17.78,16.51 0 top
C5  12.7,25.15 90 top
C7  16.51,25.15 0 top
C8  13.97,20.07 90 top
C12  17.78,9.91 180 top
C13  25.4,7.37 180 top
C14  26.67,21.34 90 top
C15  33.02,8.01 0 top
C16  33.02,9.91 180 top
C19  33.02,14.99 0 top
D1  40.64,7.37 0 top
D2  8.89,11.18 0 top
D3  8.89,2.29 0 top
D4  40.64,11.69 0 top
D5  24,1.66 0 top
D6  44.45,21.21 270 bottom
D7  40.64,15.88 0 top
D8  40.64,20.07 0 top
D9  6.99,25.4 270 top
E2  47.37,20.7 90 bottom
F1  5.08,25.15 270 top
FID1  2.54,1.02 0 bottom
FID2  48.26,26.42 0 bottom
FID3  48.26,26.42 0 top
FID4  2.54,1.02 0 top
FRAME3  91.44,-9.14 0 top  (outside the outline)
J1  45.97,4.83 90 top
J3  7.62,18.8 270 top
J4  25.4,4.83 180 top
J5  1.27,7.37 270 top
J6  33.02,3.56 180 top
JP1  6.35,2.29 180 top
JP2  2.54,25.15 270 top
JP3  6.35,12.45 180 top
JP9  36.83,2.29 270 top
LOGO1  73.66,50.55 0 top  (outside the outline)
LOGO2  44.96,5.85 90 bottom
LOGO3  44.32,4.83 90 top
LOGO4  44.45,25.15 90 bottom
LOGO5  38.23,25.91 0 top
Q1  8.89,4.83 90 top
Q2  8.89,8.64 90 top
Q3  36.83,6.1 270 top
Q4  36.83,11.18 270 top
Q5  36.83,16.26 270 top
Q6  36.83,21.34 270 top
Q7  15.24,13.72 270 top
Q8  10.16,13.72 90 top
R1  27.94,1.66 180 top
R2  33.02,20.07 0 top
R3  40.64,3.56 180 top
R4  33.02,22.61 180 top
R5  12.7,11.18 180 top
R6  40.64,1.02 180 top
R7  10.16,16.26 180 top
R8  10.16,21.34 180 top
R9  40.64,9.91 0 top
R10  13.97,4.83 90 top
R11  11.43,8.64 270 top
R12  12.7,2.29 180 top
R13  7.62,8.64 90 top
R14  11.43,4.83 270 top
R15  7.62,4.83 270 top
R16  13.97,8.64 270 top
R17  21.59,21.34 270 top
R18  29.21,21.34 90 top
R19  24.13,21.34 90 top
R20  40.64,5.46 0 top
R21  40.64,13.72 0 top
R22  40.64,18.16 0 top
R23  36.83,8.64 180 top
R24  36.83,13.72 180 top
R25  36.83,18.8 180 top
R26  36.83,23.88 180 top
R27  17.78,13.72 90 top
R28  12.7,13.72 270 top
S1  48.26,12.45 90 top
S3  19.05,4.83 90 top
TP1  48.26,1.02 0 bottom
TP2  2.03,16.26 0 bottom
TP3  48.26,11.18 0 bottom
TP4  48.26,8.64 0 bottom
TP5  1.27,2.29 0 bottom
TP6  1.27,7.37 0 bottom
TP7  1.27,12.45 0 bottom
TP8  1.27,9.91 0 bottom
TP9  1.27,4.83 0 bottom
TP10  49.53,3.56 0 bottom
TP11  49.53,6.1 0 bottom
TP12  44.45,14.99 0 bottom
TP13  44.45,12.45 0 bottom
U2  25.4,13.72 180 top
U3  17.78,21.34 180 top
U4  22.86,13.72 270 bottom
U$1  [1W1]  26.67,25.15 0 top
U$2  [RESET0]  19.05,0.77 0 top
U$4  [TRAIN0]  45.72,12.45 90 top
U$5  [RADIO2]  30.61,25.15 0 top
U$6  [01]  30.61,1.78 0 top
U$7  [PWR0]  24.13,2.8 0 top
U$8  [868MHZ0]  45.85,21.34 0 top
U$9  [ANTENNA1]  45.85,20.07 0 top
U$10  [RX1]  8.89,1.02 0 top
U$11  [TX0]  8.89,9.91 0 top
U$12  [#0]  6.22,10.54 0 top
U$13  [#1]  6.22,4.32 90 top
U$14  [R3]  6.22,5.59 90 top
U$15  [T2]  6.22,8.01 90 top
U$16  [C0]  6.22,6.74 90 top
U$17  [R1]  6.22,9.28 90 top
U$18  [LORASERIAL0]  29.21,26.42 0 top
U$19  [C50]  4.3,0.75 0 top
U$20  [R50]  4.2,13.55 0 top
U$21  [RSSI0]  43.18,14.1 90 top
U$22  [10]  33.02,1.66 0 top
U$23  [SH0]  2.67,26.93 0 top
Y1  33.02,12.45 270 top

### Tracks (layer width: path | path; a pad name or v marks a point on that pad's centre or on a via)
3.3V  (via drill 0.3)
  Top 0.203: D8.A 40.64,19.19 40.64,16.01 | 40.64,16.01 40.64,11.69 | 40.64,11.69 40.64,7.37 | 40.64,7.37 40.64,2.29 | D1.A 40.64,7.37 | D4.A 40.64,11.69 | D7.A 39.89,16.01 40.64,16.01
  Top 0.305: U2.6 26.01,13.47 | 26.01,13.47 26.01,15.73 26.15,15.87 U2.17 26.15,19.04 26.67,19.56 C14.1 26.58,20.58 v25.4,20.58 | C4.2 C3.1 18.73,18.27 U3.5 20.16,20.04 20.61,20.49 R17.2 v21.59,19.31 | R16.2 R10.2 13.13,5.68 R14.2 11.08,4.33 Q1.1 | J4.1 27.94,7.24 26.98,8.2 26.35,8.2 26.15,8.4 U2.44 26.15,10.38 26.01,10.53 26.01,11.05 | 18.67,10.97 U2.36 25.93,10.97 26.01,11.05 | C12.1 18.63,10.93 18.67,10.97 | 26.01,11.05 26.01,11.94 | 26.01,11.94 26.01,13.47 | 26.01,11.94 26.03,11.97 27.62,11.97 28.57,11.02 28.57,10.42 30.99,8.01 C15.1 32.17,6.06 33.15,5.08 34.04,5.08 34.92,4.2 34.92,2.29 | 18.67,10.97 16.39,10.97 15.11,9.7 15.11,8.93 R16.2 | R16.2 R11.2 11.08,8.14 Q2.1 | J1.2 45.09,4.33 v43.05,2.29 40.64,2.29 JP9.2 34.92,2.29 | R2.2 33.87,21.3 v33.91,21.34 | D5.A 23.13,0.88 23.37,0.64 34.29,0.64 34.92,1.27 34.92,2.29
  Digital 0.305: v21.59,19.31 22.86,20.58 v25.4,20.58 33.15,20.58 v33.91,21.34
  Bottom 0.203: TP1.1 46.99,2.29 v43.05,2.29
5V  (via drill 0.3)
  Top 0.305: 13.97,23.88 13.55,24.3 C5.1 8.93,24.3 8.89,24.26 | U3.1 18.73,23.57 18.41,23.88 17.91,23.88 | 13.97,23.88 16.76,23.88 | 16.76,23.88 17.91,23.88 | U3.3 16.83,23.81 16.76,23.88 | JP1.2 5,2.29 4.97,2.31 4.04,2.31 1.52,4.83 1.52,9.78 v3.56,11.81 | C7.+ 17.91,23.88 | JP3.2 5.83,11.57 v6.22,11.18 | Q8.2 8.55,14.67 v8.51,14.63 | Q7.4 16.04,11.73 v16,11.69 | v13.97,20.07 C8.A 13.97,23.88 | D9.C 8.12,26.55 8.89,25.79 8.89,24.26 | 8.89,24.26 v8.89,24.03
  Digital 0.305: v13.97,20.07 6.35,20.07 4.06,17.78 4.06,12.07 3.81,11.81 v3.56,11.81
  Bottom 0.178: v3.56,11.81 3.68,11.94 3.68,15.37 2.79,16.26 TP2.1
  Bottom 0.305: v8.89,24.03 U4.11 | v3.56,11.81 4.19,11.18 v6.22,11.18 8.51,11.18 | 8.51,11.18 14.69,11.18 14.97,11.46 15.77,11.46 v16,11.69 | v8.51,14.63 8.51,11.18
!CTS!-I_HV  (via drill 0.3)
  Top 0.178: Q1.3 8.47,4.83 R15.1 6.55,6.75 J5.4 3.19,6.75 v3.17,6.74
  Bottom 0.178: v3.17,6.74 1.91,6.74 TP6.1
A0  (via drill 0.3)
  Top 0.178: v28.19,12.7 28.19,12.28 28.5,11.97 U2.3 | v30.61,7.24 30.61,3.69 J6.2
  Digital 0.178: v28.19,12.7 30.61,10.29 v30.61,7.24 30.61,6.9 31.47,6.04 44.01,6.04 46.1,8.13 46.1,14.61 v45.72,14.99
  Bottom 0.178: v45.72,14.99 TP12.1
A1  (via drill 0.3)
  Top 0.178: U2.7 27.72,13.97 v27.56,14.13 | v31.51,6.99 31.5,6.98 31.5,5.76 33.02,4.24 J6.1
  Digital 0.178: v27.56,14.13 27.61,14.13 31.51,10.23 v31.51,6.99 32.1,6.4 43.86,6.4 45.74,8.28 45.74,11.15 TP13.1
  other vias: 44.45,12.45
A2/BOARD_ID
  Top 0.178: U2.8 28.71,14.47 28.57,14.61 28.57,17.53 31.11,20.07 R2.1 R4.2
A3/RSSI1
  Top 0.178: U2.9 30.58,14.97 31.55,15.95 34.34,15.95 34.76,15.53 34.76,9.19 35.31,8.64 R23.2
A4/RSSI2
  Top 0.178: U2.10 30.57,15.47 31.49,16.39 34.42,16.39 35.11,15.69 35.11,14.59 R24.2
A5/RX_LED  (via drill 0.3)
  Top 0.178: U2.47 27.65,10.76 v27.69,10.8 | v16.38,3.43 16.38,2.54 14.86,1.02 9.28,1.02 D3.A
  Digital 0.178: v27.69,10.8 27.51,10.8 26.92,11.4 26.12,11.4 18.16,3.43 v16.38,3.43
CC1
  Top 0.178: J3.A5 9.12,20.05 9.31,20.24 R8.2
CC2
  Top 0.178: J3.B5 8.52,17.05 R7.2
D2/LORA_TXEN  (via drill 0.3)
  Top 0.178: U2.23 23.15,22.23 | 23.15,22.23 23.15,23.59 v22.86,23.88 | R19.2 23.19,22.19 23.15,22.23
  Bottom 0.178: v22.86,23.88 22.1,23.88 21.6,24.38 U4.16
D3/LORA_RXEN  (via drill 0.3)
  Top 0.178: U2.14 27.65,22.23 | 27.65,22.23 27.65,22.9 v26.67,23.88 | R18.2 27.69,22.19 27.65,22.23
  Bottom 0.178: v26.67,23.88 24.51,23.88 24.13,24.26 U4.17
D4/TRAIN  (via drill 0.3)
  Top 0.178: U2.13 28.15,15.38 v27.76,14.99 | S1.1 44.62,10.5 v44.58,10.54
  Digital 0.178: v44.58,10.54 32.21,10.54 v27.76,14.99
D5/LORA_!CS!  (via drill 0.3)
  Top 0.178: U2.24 22.65,22.23 | 22.65,22.23 22.65,22.69 21.84,23.5 v20.95,23.5 | R17.1 22.61,22.19 22.65,22.23
  Bottom 0.178: v20.95,23.5 19.81,23.5 19.06,24.25 U4.15
D6/LORA_!RST!  (via drill 0.3)
  Top 0.178: U2.29 22.14,14.47 v22.48,14.81 | R16.1 13.12,8.64 v12.7,8.64
  Digital 0.178: v22.48,14.81 22.43,14.86 10.54,14.86 9.14,13.47 8.89,13.21 v8.89,6.99 v8.89,3.56
  Bottom 0.178: U4.8 v8.9,3.55 v8.89,3.56 | v12.7,8.64 10.54,8.64 v8.89,6.99
D7/LORA_D0  (via drill 0.3)
  Top 0.178: U2.30 22.86,13.97 v22.99,14.1
  Digital 0.178: v22.99,14.1 22.23,13.34 12.32,13.34 10.41,11.43 v10.41,3.59
  Bottom 0.178: U4.7 11.44,3.27 11.12,3.59 v10.41,3.59
D8/RSSI3
  Top 0.178: U2.11 30.57,15.97 33.4,18.8 R25.2
D9/RSSI4
  Top 0.178: U2.12 30.57,16.47 33.28,19.18 34.67,19.18 34.92,19.43 34.92,23.5 35.31,23.88 R26.2
D10/LORA_D1  (via drill 0.3)
  Top 0.178: v23.75,13.09 23.75,14.99 23.27,15.47 U2.27
  Digital 0.178: v23.75,13.09 23.24,12.58 15.37,12.58 14.64,11.85 14.64,5.09 14.78,4.96 v15.62,4.96
  Bottom 0.178: v15.62,4.96 14.9,4.96 13.98,4.03 U4.6
D11/SPI_PICO  (via drill 0.3)
  Top 0.178: U2.25 21.15,17.85 v21.21,17.91
  Bottom 0.178: U4.14 16.52,24.38 18.41,22.48 19.43,22.48 20.19,21.72 20.19,19.69 21.21,18.67 v21.21,17.91
D12/SPI_POCI  (via drill 0.3)
  Top 0.178: U2.28 19.96,14.97 19.56,15.37 19.56,18.93 v19.68,19.05
  Bottom 0.178: v19.68,19.05 19.68,21.72 19.28,22.13 18.27,22.13 16.13,24.26 14.1,24.26 13.97,24.39 U4.13
D13/SPI_SCK  (via drill 0.3)
  Top 0.178: U2.26 20.1,15.97 19.94,16.13 19.94,17.78 v20.32,18.16
  Digital 0.178: v20.32,18.16 20.32,20.96 17.4,23.88 11.81,23.88 11.25,23.32 v11.25,22.36
  Bottom 0.178: U4.12 11.44,22.54 v11.25,22.36
D20/SDA  (via drill 0.3)
  Top 0.178: U2.31 22.35,13.47 23.33,12.49 24,12.49 24.35,12.84 24.35,13.3 24.51,13.47 v24.51,13.59 | v47.62,5.34 v47.62,5.33 | v47.62,5.33 J1.3 | R6.1 47.12,1.02 48.13,2.04 48.13,4.81 v47.62,5.33
  Digital 0.178: v47.62,5.34 47.61,5.32 31.18,5.32 29.53,6.97 29.53,9.87 27.65,11.75 26.35,11.75 v24.51,13.59
  Bottom 0.178: v47.62,5.34 49.4,3.56 TP10.1
D21/SCL  (via drill 0.3)
  Top 0.178: U2.32 22.34,12.97 23.18,12.13 24.32,12.13 25.29,13.11 v25.29,13.99 | v47.75,6.35 47.73,6.33 J1.4 45.06,6.33 42.29,3.56 R3.1
  Digital 0.178: v25.29,13.99 25.29,13.31 26.5,12.11 27.8,12.11 29.88,10.02 29.88,7.12 31.32,5.68 34,5.68 34.29,5.68 47.08,5.68 v47.75,6.35
  Bottom 0.178: v47.75,6.35 49.28,6.35 TP11.1
D28/USB_D-
  Top 0.178: J3.A7 8.89,18.55 | J3.B7 8.78,19.55 8.89,19.43 8.89,18.55 | 8.89,18.55 10.79,18.55 11.94,17.4 12.71,17.4 14.37,15.75 18.55,15.75 19.68,14.61 19.68,12.7 19.92,12.47 U2.33
D29/USB_D+
  Top 0.178: J3.A6 6.6,19.05 6.35,18.8 6.35,18.29 6.59,18.05 J3.B6 10.79,18.05 11.79,17.05 12.56,17.05 14.22,15.39 18.4,15.39 19.33,14.46 19.33,12.56 19.92,11.97 U2.34
D30/!CTS!-I_LV  (via drill 0.3)
  Top 0.178: Q1.2 11.08,5.33 R14.1 11.52,5.68 v12.7,6.86 | U2.37 21.15,9.47 20.7,9.02 17.02,9.02 15.5,7.5 15.5,5.78 14.58,4.86 13.43,4.86 12.7,4.14 v12.7,3.81
  Digital 0.178: v12.7,3.81 v12.7,6.86
D31/TX_LED  (via drill 0.3)
  Top 0.178: v21.84,8.13 22.86,8.13 23.15,8.42 U2.38 | D2.A 8.48,11.18 9.24,10.41 14.85,10.41 v15.24,10.8
  Digital 0.178: v15.24,10.8 17.65,8.39 21.59,8.39 v21.84,8.13
D38/!RTS!-O  (via drill 0.3)
  Top 0.178: U2.22 23.65,16.26 v23.62,16.23 | J5.5 3.15,5.5 v3.05,5.59
  Digital 0.178: v23.62,16.23 22.1,16.23 21.59,15.73 7.7,15.73 6.8,16.63 5.36,16.63 4.48,15.75 4.48,11.77 2.03,9.32 2.03,6.61 v3.05,5.59
  Bottom 0.178: v3.05,5.59 2.29,4.83 TP9.1
GND  (via drill 0.3)  (118 unrouted)
  Top 0.203: C19.2 34.29,14.57 34.29,12.83 v33.91,12.45 34.29,12.07 34.29,10.33 C16.1
  Top 0.254: J3.GND2 8.51,15.57 8.63,15.46 10.21,15.46 R7.1 | J3.GND 8.3,22.02 v8.89,22.61
  other vias: 17.78,19.31 13.97,12.2 17.78,21.09 15.24,20.07 9.65,6.35 20.32,24.13 20.32,22.61 25.4,22.61 29.21,19.31 25.4,19.43 25.27,16.51 25.27,11.69 31.5,13.47 38.61,17.53 36.83,11.18 20.07,9.91 12.19,20.83 4.7,3.18 4.45,1.4 29.21,2.8 39.37,8.77 42.93,11.69 43.94,8.01 46.99,16.51 44.45,18.04 43.31,16.51 41.66,16.89 44.45,19.43 44.45,23.25 46.99,24.9 42.29,22.36 40.64,21.21 28.45,25.91 28.32,24.26 3.81,26.8 4.95,23.12 47.24,3.31 22.61,11.69 38.35,7.37 19.05,7.37 44.45,9.15 17.78,11.69 15.11,3.43 36.83,16.26 36.83,21.34 33.02,9.02 20.32,3.56 44.45,24.9 45.72,24.9 48.26,24.9 44.45,16.51 45.72,16.51 48.26,16.51 43.43,22.36 41.15,22.36 19.05,11.69 12.32,16.39 15.88,8.89 15.11,16.51 10.29,19.31 6.22,4.83 33.91,17.53 26.92,12.7 26.67,14.23 3.81,21.34 3.81,18.8 30.48,17.53 34.29,23.88
  pour Top (isolate 0.203): 1.27,-0.25 1.27,27.69 49.53,27.69 49.53,-0.25
  pour Digital (isolate 0.203): 1.27,-0.25 1.27,27.69 49.53,27.69 49.53,-0.25
  pour GND (isolate 0.203): 1.27,-0.25 1.27,27.69 49.53,27.69 49.53,-0.25
  pour Bottom (isolate 0.254): 1.27,-0.25 1.27,27.69 49.53,27.69 49.53,-0.25
LORA_ANT
  Bottom 0.36: U4.19 D6.2 47.36,20.71
  Bottom 0.739: 47.36,20.71 E2.SIG
N$1
  Top 0.178: U2.2 31.41,11.47 32.28,12.34 32.28,13.7 | C19.1 32.26,14.9 32.26,13.72 32.28,13.7 | 32.28,13.7 Y1.P$1
N$2
  Top 0.178: U2.1 31.54,10.97 31.77,11.2 32.13,11.2 | 32.13,11.2 Y1.P$2 | C16.2 32.17,11.16 32.13,11.2
N$3
  Top 0.178: D3.C R12.2
N$4
  Top 0.178: R5.2 D2.C
N$5
  Top 0.178: JP3.1 6.87,10.24 R13.2
N$6
  Top 0.178: JP1.1 6.87,3.23 R15.2
N$7
  Top 0.178: D5.C R1.2
N$8
  Top 0.178: D4.C 41.52,9.94 R9.2
N$9
  Top 0.178: D1.C 41.52,5.49 R20.2
N$10
  Top 0.178: D7.C 41.52,13.75 R21.2
N$11
  Top 0.178: D8.C 41.52,18.19 R22.2
N$12
  Top 0.178: R20.1 38.69,5.46 38.06,6.1 Q3.3
N$13
  Top 0.178: Q3.1 36.98,7.05 37.68,7.75 R23.1
N$14
  Top 0.178: R9.1 38.44,9.91 37.93,10.42 Q4.3
N$15
  Top 0.178: Q4.1 36.85,12.13 37.68,12.96 R24.1
N$16
  Top 0.178: R21.1 37.93,15.58 Q5.3
N$17
  Top 0.178: Q5.1 36.85,17.21 37.68,18.04 R25.1
N$18
  Top 0.178: R22.1 37.93,20.02 Q6.3
N$19
  Top 0.178: Q6.1 37.11,22.29 37.68,22.86 R26.1
N$20
  Top 0.305: JP2.2 2.54,23.14 J3.SHLD5
N$21
  Top 0.305: Q8.1 12.6,12.77 R28.2 12.9,13.07 Q7.3
N$22
  Top 0.305: Q7.6 16.89,14.37 | 16.89,14.37 17.58,14.37 R27.2 | 16.89,14.37 16.89,13.85 16.76,13.72 Q7.5 Q7.2
RX-I_HV  (via drill 0.3)
  Top 0.178: Q2.3 8.47,8.64 R13.1 6.17,9.24 J5.2 3.33,9.24 v3.17,9.4
  Bottom 0.178: TP7.1 3.17,10.54 v3.17,9.4
RX-I_LV  (via drill 0.3)
  Top 0.178: Q2.2 11.08,9.14 R11.1 12.15,9.49 v12.45,9.78 | v26.92,15.12 26.65,15.39 U2.16
  Digital 0.178: v12.45,9.78 12.45,11.94 13.49,12.98 22.71,12.98 24.85,15.12 v26.92,15.12
SAMD_!RESET!  (via drill 0.3)
  Top 0.178: U2.40 24.15,8.41 21.59,5.85 21.59,4.32 | S3.1 v17.14,4.32 | v17.14,4.32 S3.2 | R10.1 14.64,3.98 14.99,4.32 v17.14,4.32 | J4.10 22.73,4.2 22.61,4.32 21.59,4.32 | 21.59,4.32 v17.14,4.32
  Bottom 0.203: v17.14,4.32 17.12,4.32 15.87,5.57 4.55,5.57 TP5.1
SCL_PU1
  Top 0.178: JP9.1 38.12,3.33 38.35,3.56 R3.2
SDA_PU1
  Top 0.178: JP9.3 38.25,1.25 38.48,1.02 R6.2
SWCLK  (via drill 0.3)
  Top 0.178: U2.45 26.65,10.78 v26.67,10.8
  Digital 0.178: v26.67,10.8 29.16,8.31 29.16,6.82 29.16,6.1 | J4.4 27.56,3.31 28.83,3.31 29.16,3.64 29.16,6.1 | TP4.1 48.26,6.71 48.36,6.61 48.36,5.21 47.88,4.73 47.37,4.73 47.15,4.95 31.03,4.95 29.88,6.1 29.16,6.1
  other vias: 48.26,8.64
SWDIO  (via drill 0.3)
  Top 0.178: U2.46 27.15,8.67 28.83,6.99 28.83,5.08 J4.2
  Top 0.203: 28.83,5.08 29.72,5.08 v29.84,4.96
  Digital 0.178: v46.99,9.28 47.02,9.25 48.51,9.25 48.87,8.89 48.87,5.18 48.03,4.35 47.22,4.35 46.99,4.58 33.46,4.58 33.45,4.59 30.85,4.59 30.47,4.96 v29.84,4.96
  Bottom 0.203: v46.99,9.28 48.26,10.54 TP3.1
TX-O  (via drill 0.3)
  Top 0.178: v27.3,16.26 27.15,16.41 U2.15 | v6.48,7.75 6.23,7.99 J5.3 3.19,7.99 v3.17,8.01
  Digital 0.178: v6.48,7.75 8.51,9.78 8.51,13.47 10.3,15.26 21.73,15.26 22.1,15.62 26.16,15.62 26.8,16.26 v27.3,16.26
  Bottom 0.178: v3.17,8.01 TP8.1
V_USB
  Top 0.305: F1.2 D9.A
VCC_CABLE
  Top 0.178: Q8.3 13.34,13.72 13.98,14.37 Q7.1
  Top 0.305: Q8.3 8.99,13.65 5.14,13.65 4.57,13.08 J5.1
VDDCORE
  Top 0.178: U2.43 25.65,7.97 C13.1
VUSB
  Top 0.305: J3.VBUS1 6.66,21.25 6.45,21.04 5.89,21.04 | 5.89,21.04 3.81,23.12 3.81,25.02 4.25,25.47 4.34,25.56 4.84,26.05 F1.1 | J3.VBUS2 6.77,16.35 5.93,17.19 5.93,21 5.89,21.04

### Text on the board
Top: v13
Milling: Route Out | Route Out
Measures: Dimensions in mm
tDocu: 4-Layer PCB / JLC7628 Impedance Controlled / 1.6mm Thickness / 1oz Copper / HASL RoHS Finish | N. Seidle